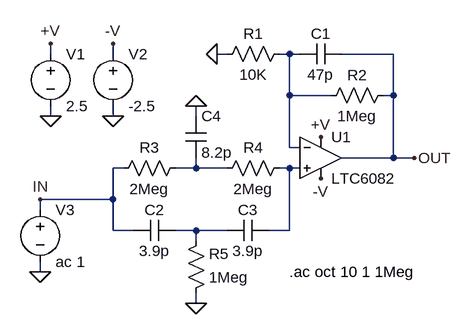
[diagram p0: schematic LTC6082.asc]
LTC6082.asc, the LTspice schematic file:
Version 4
SHEET 1 880 680
WIRE -176 48 -176 32
WIRE -80 48 -80 32
WIRE 96 48 80 48
WIRE 192 48 176 48
WIRE 208 48 192 48
WIRE 352 48 272 48
WIRE 192 112 192 48
WIRE 256 112 192 112
WIRE 352 112 352 48
WIRE 352 112 336 112
WIRE -176 144 -176 128
WIRE -80 144 -80 128
WIRE 48 144 48 128
WIRE 192 192 192 112
WIRE 208 192 192 192
WIRE 352 208 352 112
WIRE 352 208 272 208
WIRE 384 208 352 208
WIRE -64 224 -80 224
WIRE 48 224 48 208
WIRE 48 224 16 224
WIRE 96 224 48 224
WIRE 192 224 176 224
WIRE 208 224 192 224
WIRE -80 272 -80 224
WIRE -80 272 -192 272
WIRE -192 288 -192 272
WIRE -80 320 -80 272
WIRE -48 320 -80 320
WIRE 48 320 16 320
WIRE 96 320 48 320
WIRE 192 320 192 224
WIRE 192 320 160 320
WIRE 48 336 48 320
WIRE -192 384 -192 368
WIRE 48 432 48 416
FLAG -176 144 0
FLAG -80 144 0
FLAG 240 176 +V
FLAG -176 32 +V
FLAG -80 32 -V
FLAG 240 240 -V
FLAG 80 48 0
FLAG -192 384 0
FLAG 48 432 0
FLAG 48 128 0
FLAG -192 272 IN
FLAG 384 208 OUT
SYMBOL voltage -176 32 R0
SYMATTR InstName V1
SYMATTR Value 2.5
SYMBOL voltage -80 32 R0
SYMATTR InstName V2
SYMATTR Value -2.5
SYMBOL cap 272 32 R90
WINDOW 0 0 32 VBottom 2
WINDOW 3 32 32 VTop 2
SYMATTR InstName C1
SYMATTR Value 47p
SYMBOL res 192 32 R90
WINDOW 0 0 56 VBottom 2
WINDOW 3 32 56 VTop 2
SYMATTR InstName R1
SYMATTR Value 10K
SYMBOL res 352 96 R90
WINDOW 0 0 56 VBottom 2
WINDOW 3 32 56 VTop 2
SYMATTR InstName R2
SYMATTR Value 1Meg
SYMBOL voltage -192 272 R0
SYMATTR InstName V3
SYMATTR Value ac 1
SYMBOL res 32 208 R90
WINDOW 0 0 56 VBottom 2
WINDOW 3 32 56 VTop 2
SYMATTR InstName R3
SYMATTR Value 2Meg
SYMBOL res 192 208 R90
WINDOW 0 0 56 VBottom 2
WINDOW 3 32 56 VTop 2
SYMATTR InstName R4
SYMATTR Value 2Meg
SYMBOL res 32 432 M180
WINDOW 0 36 76 Left 2
WINDOW 3 36 40 Left 2
SYMATTR InstName R5
SYMATTR Value 1Meg
SYMBOL cap 16 304 R90
WINDOW 0 0 32 VBottom 2
WINDOW 3 32 32 VTop 2
SYMATTR InstName C2
SYMATTR Value 3.9p
SYMBOL cap 160 304 R90
WINDOW 0 0 32 VBottom 2
WINDOW 3 32 32 VTop 2
SYMATTR InstName C3
SYMATTR Value 3.9p
SYMBOL cap 32 208 M180
WINDOW 0 24 64 Left 2
WINDOW 3 24 8 Left 2
SYMATTR InstName C4
SYMATTR Value 8.2p
SYMBOL opamps\\LTC6082 240 208 R0
SYMATTR InstName U1
TEXT 192 384 Left 2 !.ac oct 10 1 1Meg

The netlist it stands for:
* LTC6082.asc
V1 +V 0 2.5
V2 -V 0 -2.5
C1 OUT N001 47p
R1 N001 0 10K
R2 OUT N001 1Meg
V3 IN 0 ac 1
R3 N002 IN 2Meg
R4 N003 N002 2Meg
R5 0 N004 1Meg
C2 N004 IN 3.9p
C3 N003 N004 3.9p
C4 N002 0 8.2p
* U1: LTC6082 (symbol opamps\LTC6082 not available, pins judged from their places): In+=N003 In-=N001 V+=+V V-=-V OUT=OUT
.ac oct 10 1 1Meg
.backanno
.end